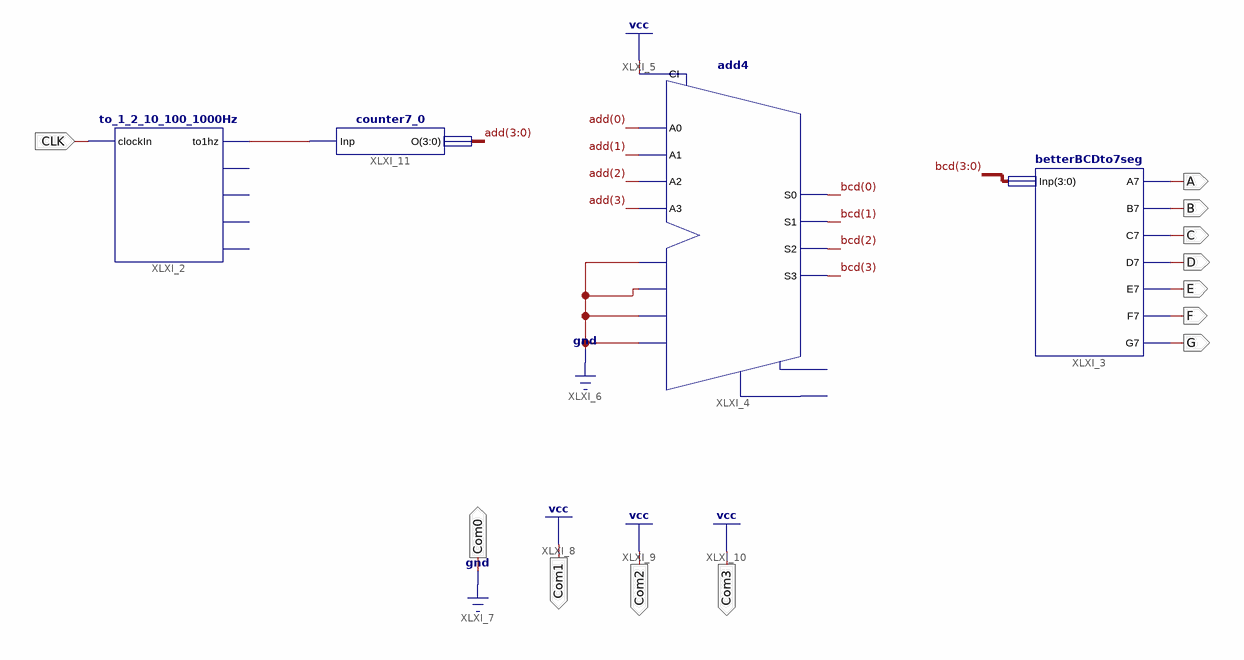
[diagram p0: schematic sheet 1]
// Xilinx ISE schematic main.sch (spartan6) as structural Verilog: 4 symbols, 12 ports
module main (
  input  CLK,
  output Com0,
  output Com1,
  output Com2,
  output Com3,
  output A,
  output B,
  output C,
  output D,
  output E,
  output F,
  output G
);

  wire XLXN_3;
  wire [3:0] add, bcd;

  to_1_2_10_100_1000Hz XLXI_2 (.clockIn(CLK), .to1hz(XLXN_3));  // open: to2hz, to10hz, to100hz, to1000hz
  betterBCDto7seg XLXI_3 (.Inp(bcd), .A7(A), .B7(B), .C7(C), .D7(D), .E7(E), .F7(F), .G7(G));
  add4 XLXI_4 (
    .A0(add[0]), .A1(add[1]), .A2(add[2]), .A3(add[3]), .B0(1'b0), .B1(1'b0), .B2(1'b0), .B3(1'b0),
    .CI(1'b1), .S0(bcd[0]), .S1(bcd[1]), .S2(bcd[2]), .S3(bcd[3]));  // open: CO, OFL
  counter7_0 XLXI_11 (.Inp(XLXN_3), .O(add));

  assign Com0 = 1'b0;
  assign Com1 = 1'b1;
  assign Com2 = 1'b1;
  assign Com3 = 1'b1;
endmodule
